# EAGLE design qtpy_synth2a (EAGLE 9.6.2)
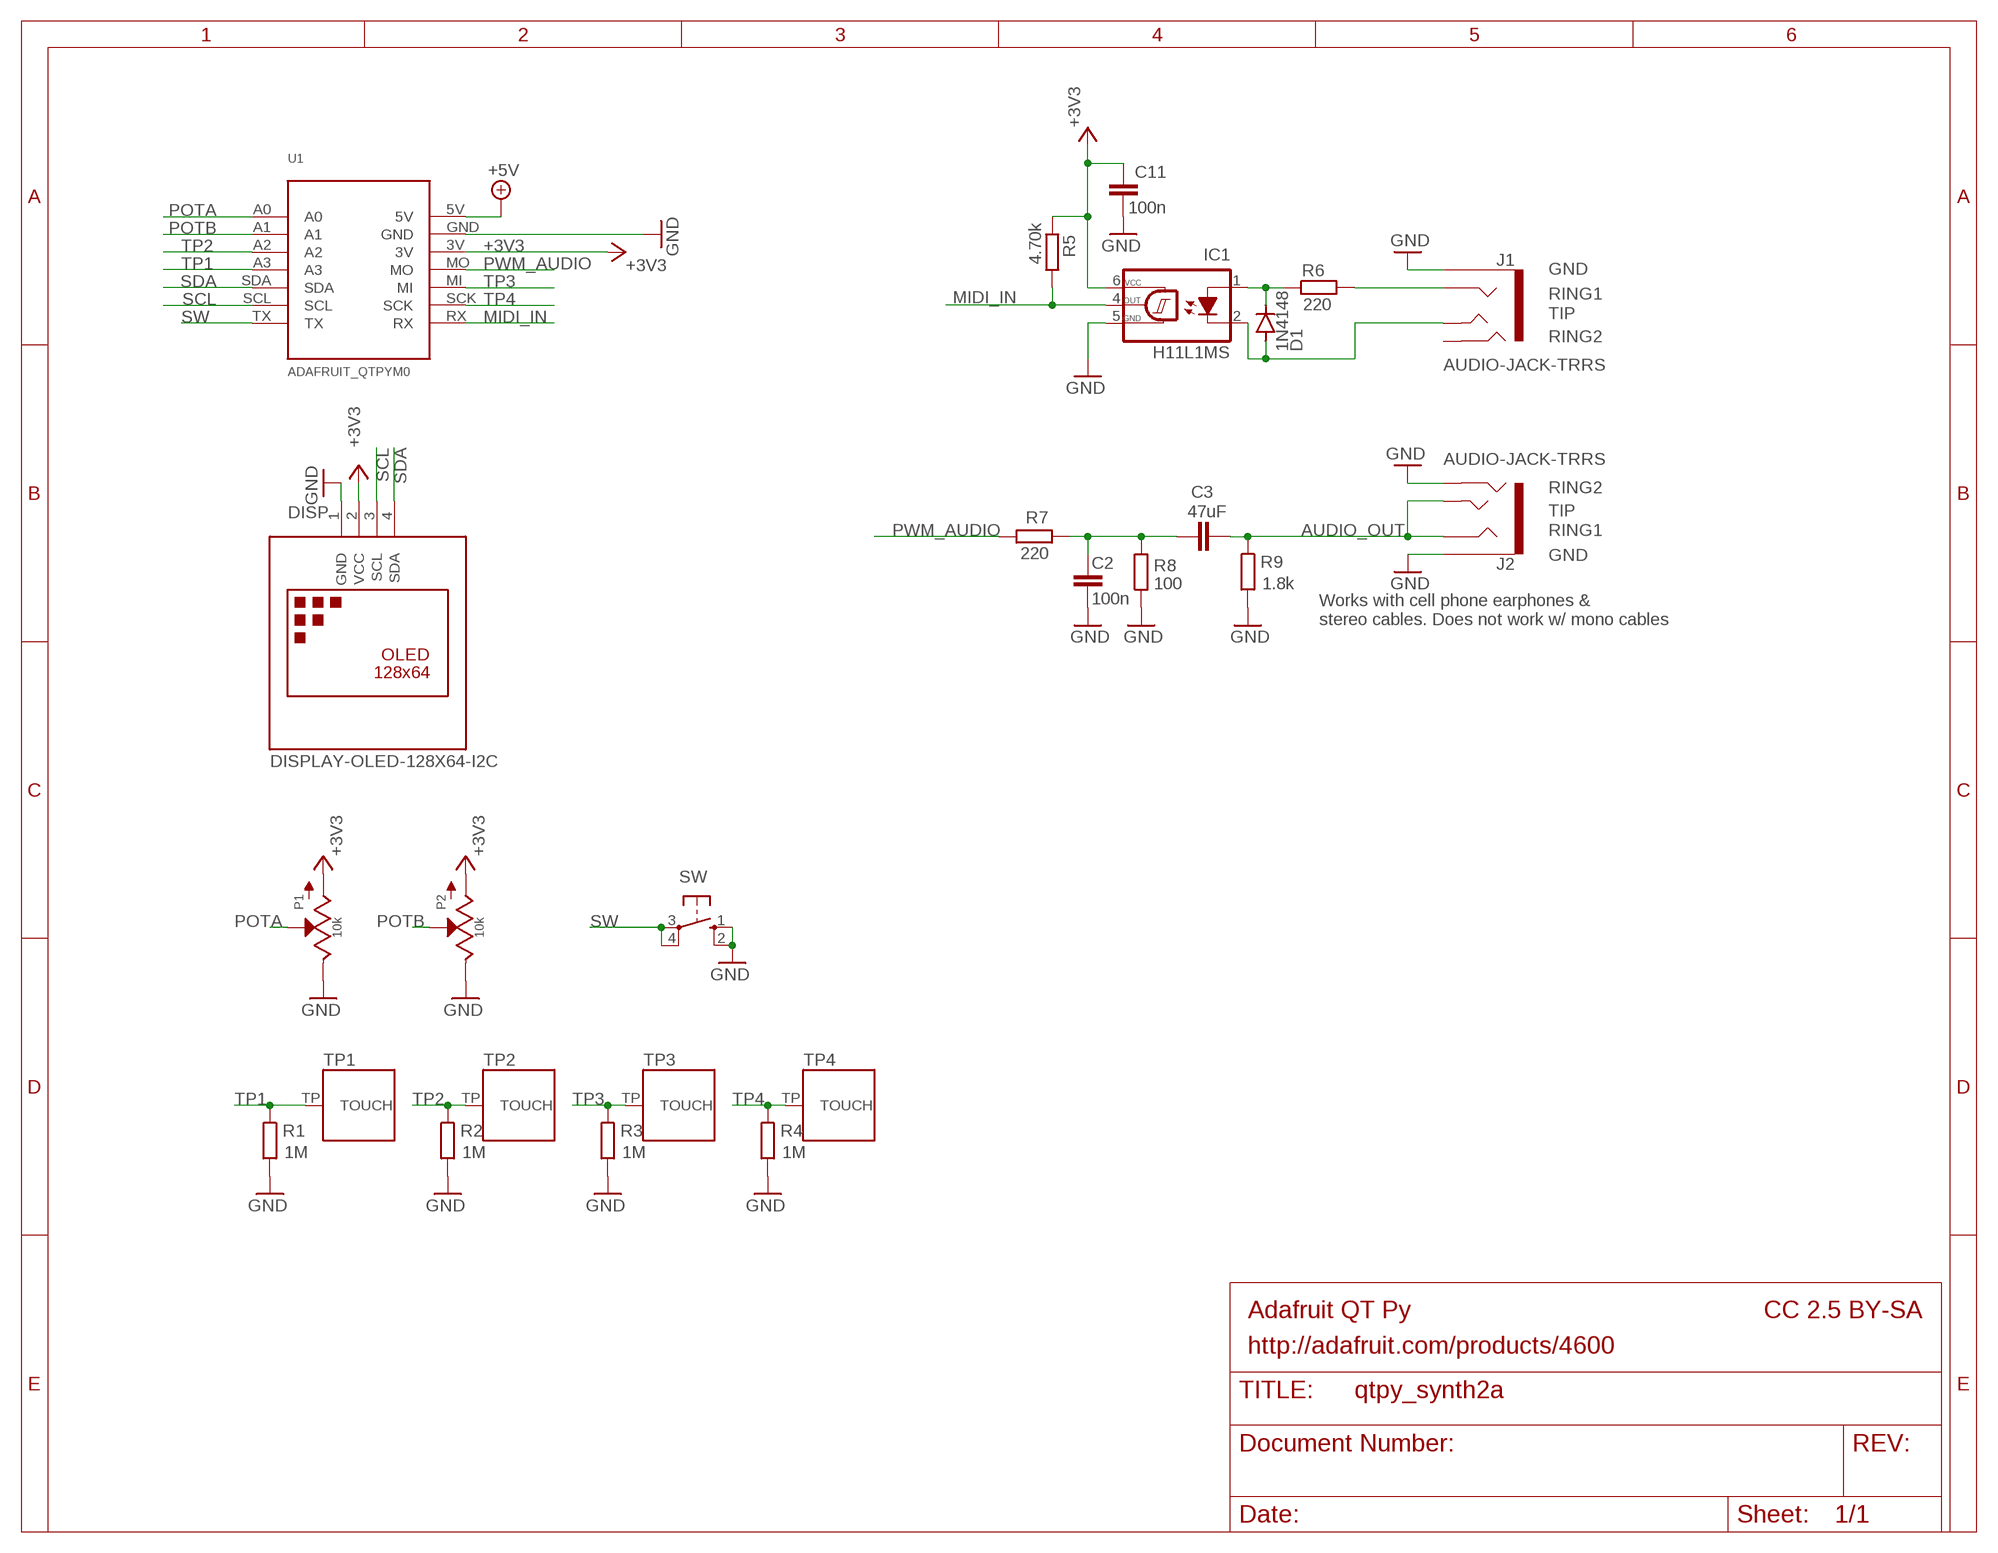
[diagram p0: schematic, sheet 1]

## Parts
C2  100n  C-EUC0805  [C0805]
C3  47uF  C-EUC0805  [C0805]
C11  100n  C-EUC0805  [C0805]
D1  1N4148  DIODE-SOD123  [SOD123]
DISP  DISPLAY-OLED-128X64-I2C  [DISPLAY-OLED-128X64-I2C]
IC1  H11L1MS  [DIL6-SMD]
J1  AUDIO-JACK-TRRS  [PJ-320D_SPARKFUN]
J2  AUDIO-JACK-TRRS  [PJ-320D_SPARKFUN]
P1  10k  POTZEPHPOT_BIGKNOB  [OG-POTS_ALPS_POT_VERTICAL_WITHBIGKNOB]
P2  10k  POTZEPHPOT_BIGKNOB  [OG-POTS_ALPS_POT_VERTICAL_WITHBIGKNOB]
R1  1M  R-EU_R0805  [R0805]
R2  1M  R-EU_R0805  [R0805]
R3  1M  R-EU_R0805  [R0805]
R4  1M  R-EU_R0805  [R0805]
R5  4.70k  R-EU_R0805  [R0805]
R6  220  R-EU_R0805  [R0805]
R7  220  R-EU_R0805  [R0805]
R8  100  R-EU_R0805  [R0805]
R9  1.8k  R-EU_R0805  [R0805]
SW  10-XX  [B3F-10XX]
TP1  TOUCHPADA  [TOUCHPADA_0.5IN]
TP2  TOUCHPADA  [TOUCHPADA_0.5IN]
TP3  TOUCHPADA  [TOUCHPADA_0.5IN]
TP4  TOUCHPADA  [TOUCHPADA_0.5IN]
U1  ADAFRUIT_QTPYM0  [ADAFRUIT_QTPY_M0]

## Nets
+3V3: C11.1 DISP.2(VCC) IC1.6(VCC) P1.P$3(A) P2.P$3(A) R5.1 U1.3V
+5V [power]: U1.5V
AUDIO_OUT: C3.2 J2.RING1 J2.TIP R9.1
GND [power]: C2.2 C11.2 DISP.1(GND) IC1.5(GND) J1.EARTH J2.EARTH J2.RING2 P1.P$1(E) P2.P$1(E) R1.2 R2.2 R3.2 R4.2 R8.1 R9.2 SW.1(S) SW.2(S1) U1.GND
MIDI_IN: IC1.4(OUT) R5.2 U1.RX
N$2: J1.RING1 R6.2
N$13: D1.C IC1.1(A) R6.1
N$14: D1.A IC1.2(C) J1.TIP
N$48: C2.1 C3.1 R7.1 R8.2
POTA: P1.P$2(S) U1.A0
POTB: P2.P$2(S) U1.A1
PWM_AUDIO: R7.2 U1.MO
SCL: DISP.3(SCL) U1.SCL
SDA: DISP.4(SDA) U1.SDA
SW [power]: SW.3(P) SW.4(P1) U1.TX
TP1: R1.1 TP1.TP(TOUCH) U1.A3
TP2: R2.1 TP2.TP(TOUCH) U1.A2
TP3: R3.1 TP3.TP(TOUCH) U1.MI
TP4: R4.1 TP4.TP(TOUCH) U1.SCK
Unconnected: J1.RING2

## Notes on the sheet
- GND
- RING1
- TIP
- RING2
- RING2
- TIP
- RING1
- GND
- Works with cell phone earphones &
  stereo cables. Does not work w/ mono cables
- Adafruit QT Py | CC 2.5 BY-SA
- http://adafruit.com/products/4600

## Library data of the parts
C2 C3 C11 = rcl:C-EU: CAPACITOR, European symbol; SPICEPREFIX: C
D1 = diode:DIODE-: DIODE
DISP = diy-modules:DISPLAY-OLED-128X64-I2C: 128x64 Dot Matrix OLED Module based on SSD1306 chip Variant with I2C interface More details available here: http://www.instructables.com/id/Monochrome-096-i2c-OLED-display-with-arduino-SSD13/ SSD1306 datasheet: https://cdn-shop.adafruit.com/datasheets/SSD1306.pdf Click here to find device on ebay.com <http://www.ebay.com/sch/oled+display+128x64+iic> Note: There are two variants: I2C and SPI. Search for the proper version.
IC1 = optocoupler:H11L*M: 6-Pin DIP Optocoupler Source: http://www.fairchildsemi.com/ds/H1/H11L2-M.pdf; LCSC: C78589; MPN2: H11L1S; OC_FARNELL: unknown; OC_NEWARK: unknown
J1 J2 = audio_jacks_todbot:AUDIO-JACK-TRRS; LCSC: C431535; MPN: PJ-320D
P1 P2 = EurorackModularParts:POT
R1-R9 = rcl:R-EU_: RESISTOR, European symbol; SPICEPREFIX: R
SW = switch-omron:10-XX: OMRON SWITCH; MPN: B3F-1000; OC_FARNELL: 176432; OC_NEWARK: 36M3542
TP1-TP4 = todstuff2023:TOUCHPAD
U1 = todstuff2023:ADAFRUIT_QTPY

## Net classes
1 power: width 0.305 mm
2 thickpower: width 0.406 mm

## Board
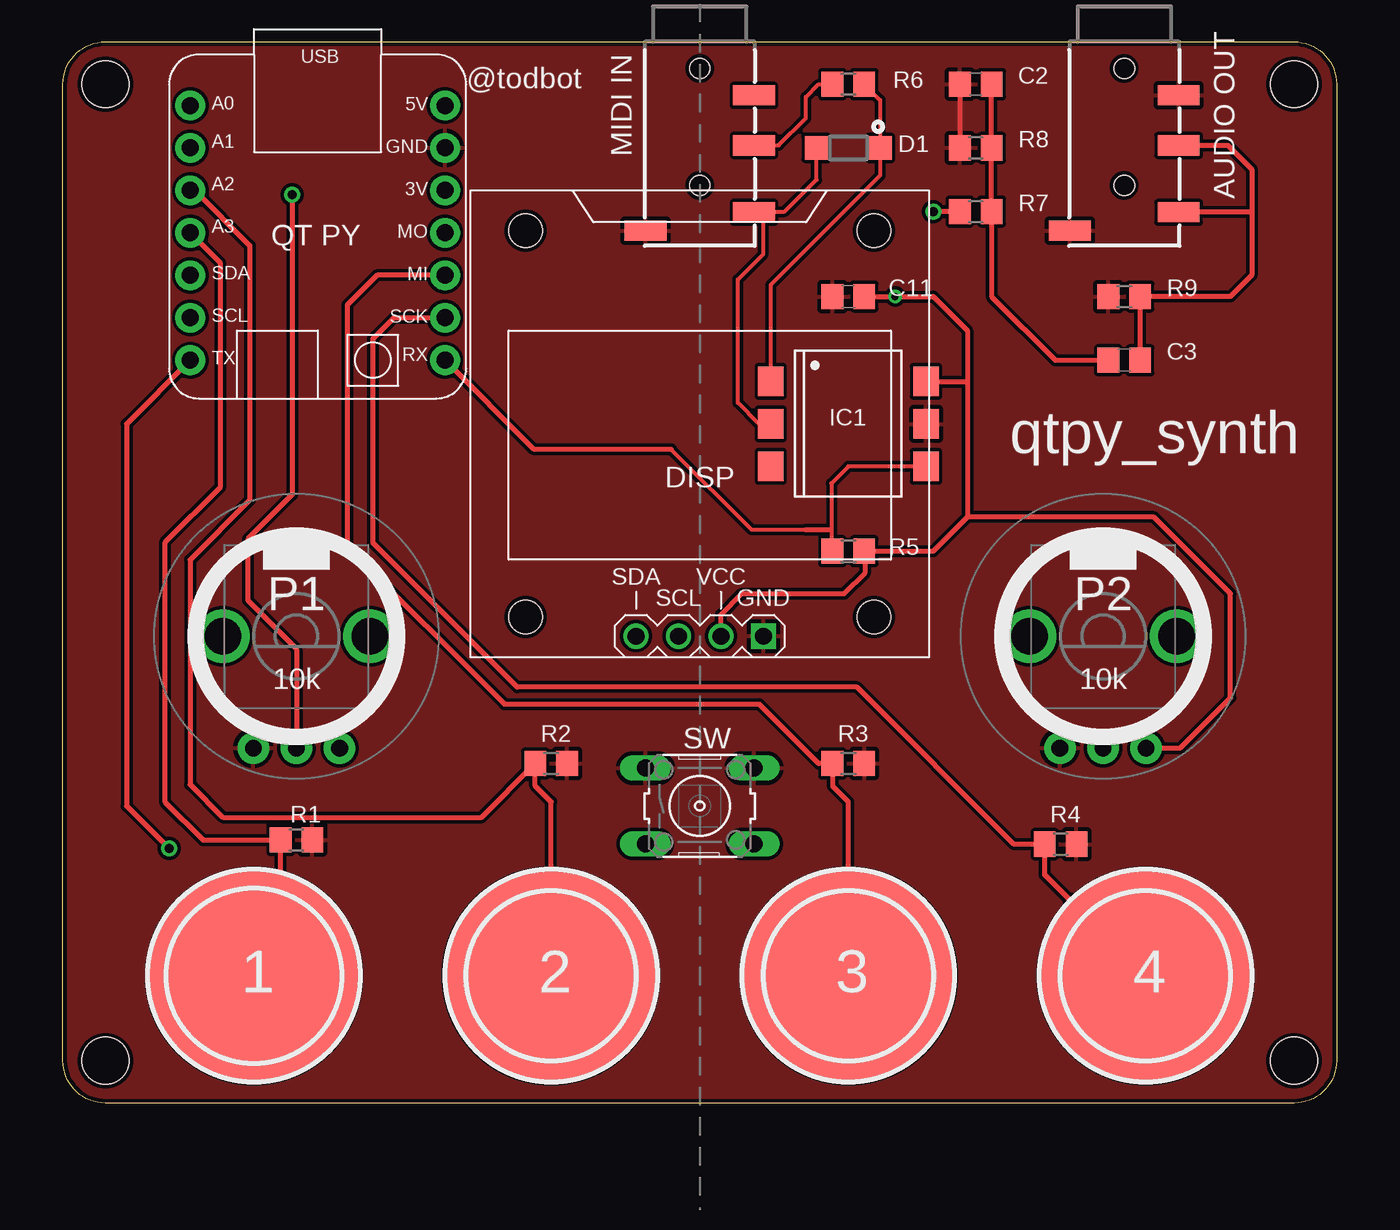
[diagram p1: board, top side]
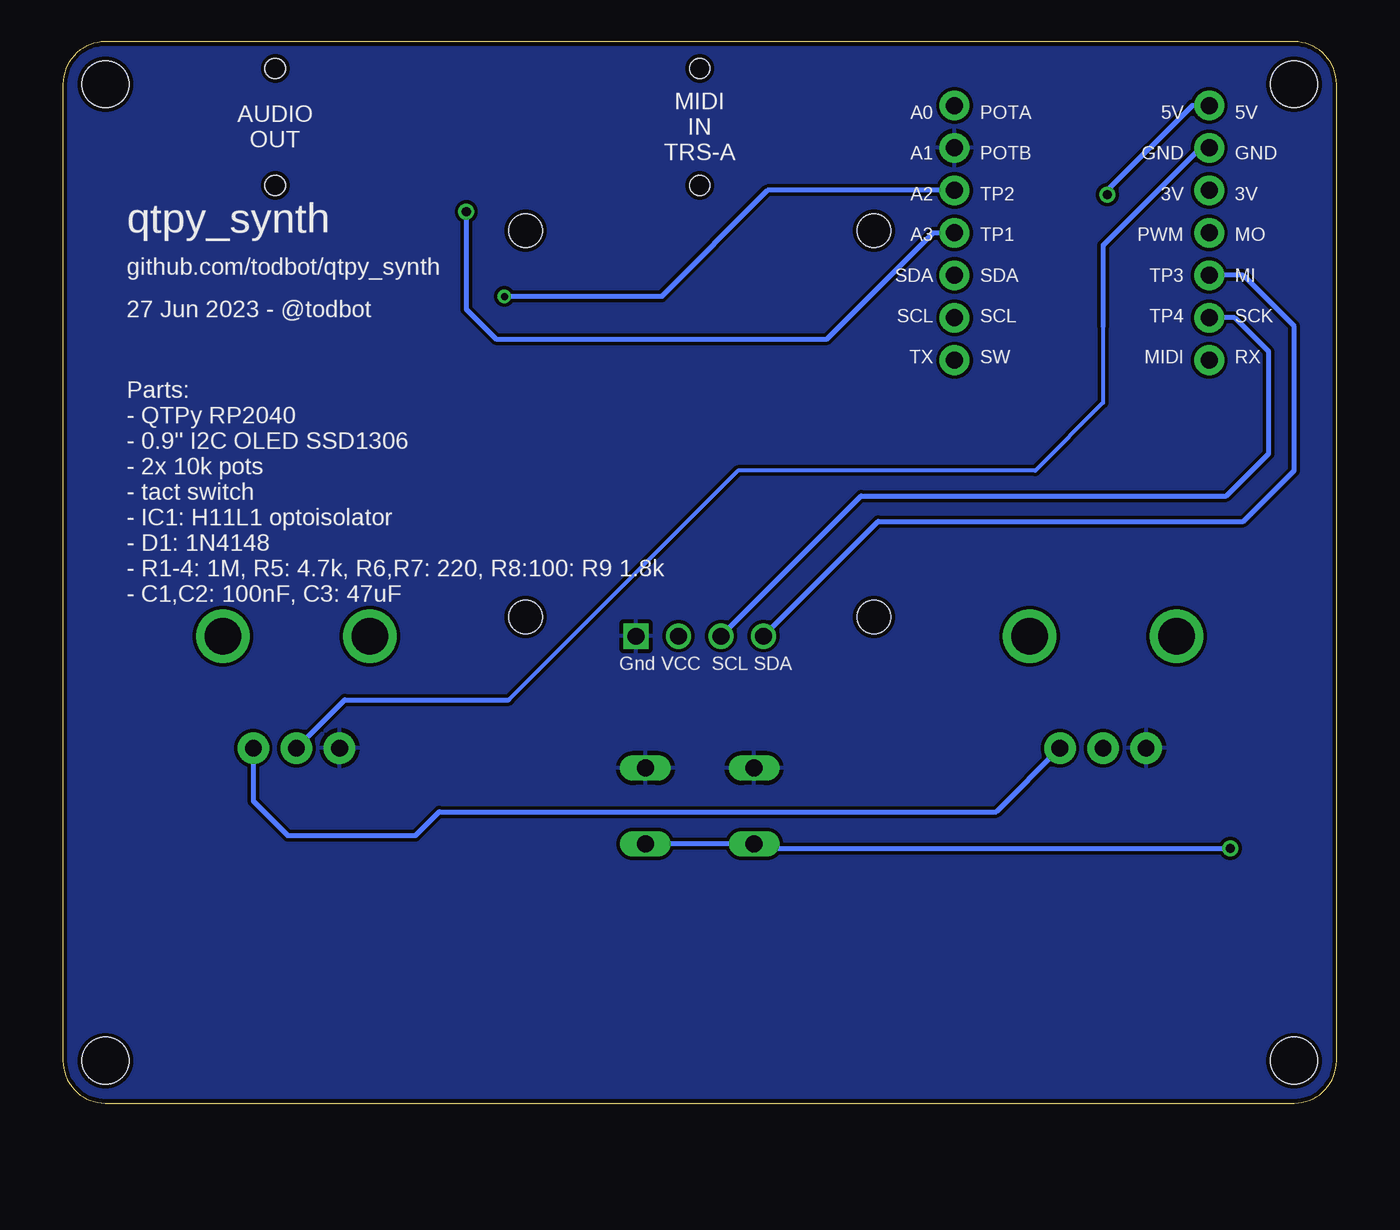
[diagram p2: board, bottom side, seen from below]

Size 76.2 x 63.5 mm. Coordinates in mm from the lower left corner, seen from the top.
Outline: 0,2.54 0,60.96 arc-90 2.54,63.5 73.66,63.5 arc-90 76.2,60.96 76.2,2.54 arc-90 73.66,0 2.54,0 arc-90 0,2.54
Copper layers (1*16): Top 0.035mm / dielectric 1.5mm / Bottom 0.035mm
Design rules "adafruit-rules-20180530 *": minimum track width 8mil, minimum drill 16mil, track to track 8mil, track to pad 8mil, pad to pad 8mil, via to via 8mil, smd to smd 8mil, copper to edge 10mil, drill to drill 8mil, minimum pad ring 10mil, minimum via ring 8mil, stop-mask expansion 4mil, vias tented up to drill 20mil, thermal gap 10mil
Holes 2.79 mm at 2.54,60.96 2.54,2.54 73.66,2.54 73.66,60.96

### Footprints (pad centres in the part's own frame; a part is rotated, then mirrored left to right if it is on the bottom)
C0805 = smd 1.3 x 1.5: 1 -0.95,0; 2 0.95,0
SOD123 = smd 1.4 x 1.4: A 1.9,0; C -1.9,0
DISPLAY-OLED-128X64-I2C = drill 1 square: 1 -3.81,12.7 | drill 1: 2 -1.27,12.7; 3 1.27,12.7; 4 3.81,12.7 | hole 2: -10.414,11.557; 10.414,11.557; 10.414,-11.557; -10.414,-11.557
DIL6-SMD = smd 1.78 x 1.52: 1 -2.54,-4.645; 2 0,-4.645; 3 2.54,-4.645; 4 2.54,4.645; 5 0,4.645; 6 -2.54,4.645
PJ-320D_SPARKFUN = smd 1.2 x 2.5: EARTH 11.3,-3.25; RING1 6.2,3.25; RING2 3.2,3.25; TIP 10.2,3.25 | hole 1.2: 1.6,0; 8.6,0
OG-POTS_ALPS_POT_VERTICAL_WITHBIGKNOB = drill 1 pad 1.88: P$1 -2.58,-6.7; P$2 0,-6.7; P$3 2.58,-6.7 | drill 2.2 pad 3.175: P$4 4.4,0; P$5 -4.4,0
R0805 = smd 1.3 x 1.5: 1 -0.95,0; 2 0.95,0
B3F-10XX = drill 1.016 long: 1 -3.251,2.261; 2 3.251,2.261; 3 -3.251,-2.261; 4 3.251,-2.261
TOUCHPADA_0.5IN = smd 12.7 x 12.7: TP 0,0
ADAFRUIT_QTPY_M0 = drill 1.016 pad 1.778: 3V 7.62,2.54; 5V 7.62,7.62; A0 -7.62,7.62; A1 -7.62,5.08; A2 -7.62,2.54; A3 -7.62,0; GND 7.62,5.08; MI 7.62,-2.54; MO 7.62,0; RX 7.62,-7.62; SCK 7.62,-5.08; SCL -7.62,-5.08; SDA -7.62,-2.54; TX -7.62,-7.62

### Placement (x,y rotation side)
C2  54.61,60.96 180 top
C3  63.5,44.45 0 top
C11  46.99,48.26 180 top
D1  46.99,57.15 180 top
DISP  38.1,40.64 180 top
IC1  46.99,40.64 270 top
J1  38.1,63.5 270 top
J2  63.5,63.5 270 top
P1  13.97,27.94 0 top
P2  62.23,27.94 0 top
PLABEL19  [PLABEL19]  8.89,63.5 0 bottom
R1  13.97,15.75 0 top
R2  29.21,20.32 0 top
R3  46.99,20.32 0 top
R4  59.69,15.49 0 top
R5  46.99,33.02 180 top
R6  46.99,60.96 180 top
R7  54.61,53.34 180 top
R8  54.61,57.15 0 top
R9  63.5,48.26 180 top
SW  38.1,17.78 0 top
TP1  11.43,7.62 0 top
TP2  29.21,7.62 0 top
TP3  46.99,7.62 0 top
TP4  64.77,7.62 0 top
U1  15.24,52.07 0 top

### Tracks (layer width: path | path; a pad name or v marks a point on that pad's centre or on a via)
+3V3  (via drill 0.41)
  Top 0.305: P2.P$3 66.84,21.24 69.85,24.25 69.85,30.48 65.28,35.05 54.1,35.05 | DISP.2 39.37,29.21 40.64,30.48 46.74,30.48 48.01,31.75 48.01,32.95 R5.1 52.07,33.02 54.1,35.05 | 54.1,43.18 54.1,46.23 52.07,48.26 v49.78,48.26 C11.1 | 54.1,43.18 54.1,35.05 | IC1.6 54.1,43.18
  Bottom 0.305: P1.P$3 20.36,17.43 53.69,17.43 55.12,16 62.74,16 64.81,18.07 P2.P$3 | v49.78,48.26 40.39,48.26 34.04,54.61 U1.3V
AUDIO_OUT
  Top 0.305: C3.2 R9.1 69.85,48.26 71.12,49.53 71.12,53.34 | J2.RING1 69.7,57.3 71.12,55.88 71.12,53.34 | J2.TIP 66.79,53.34 71.12,53.34
GND
  Top 0.305: C2.2 R8.1
  pour Bottom: 0,0 0,63.75 76.2,63.75 76.2,0
  pour Top: 0,63.5 77.47,63.5 77.47,0 0,0
MIDI_IN
  Top 0.254: 36.4,39.12 41.22,34.29 44.45,34.29 | IC1.4 46.99,38.1 45.97,37.08 45.97,34.29 45.97,33.02
  Top 0.305: U1.RX 28.19,39.12 36.4,39.12 | R5.2 45.97,33.02 | 45.97,34.29 44.45,34.29
N$2
  Top 0.254: J1.RING1 42.82,57.3 44.45,58.93 44.45,60.2 45.21,60.96 R6.2
N$13
  Top 0.254: R6.1 48.89,60.01 D1.C 48.89,55.49 42.34,48.95 IC1.1
N$14
  Top 0.254: J1.TIP 41.39,53.34 41.91,53.34 | 41.91,53.34 43.18,53.34 45.09,55.25 D1.A | IC1.2 41.66,40.64 40.39,41.91 40.39,48.26 40.39,49.28 41.91,50.8 41.91,53.34
N$48
  Top 0.305: C2.1 R8.2 R7.1 55.56,48.26 59.37,44.45 C3.1
POTA  (via drill 0.55)
  Top 0.305: v13.72,54.36 13.72,36.41 11.06,33.75 11.06,30.1 13.97,27.18 P1.P$2
  Bottom 0.305: U1.A0 8.64,59.69 13.72,54.61 v13.72,54.36
POTB
  Bottom 0.254: 13.97,46.48 13.97,41.91 18.03,37.85 35.81,37.85 49.53,24.13
  Bottom 0.305: U1.A1 8.13,57.15 13.97,51.31 13.97,46.48 | P2.P$2 59.34,24.13 49.53,24.13
PWM_AUDIO  (via drill 0.55)
  Top 0.305: R7.2 v52.07,53.34
  Bottom 0.305: v52.07,53.34 52.07,47.5 50.29,45.72 30.48,45.72 24.13,52.07 U1.MO
SCL
  Bottom 0.305: U1.SCL 6.1,46.99 4.06,44.96 4.06,38.86 6.6,36.32 28.45,36.32 DISP.3
SDA
  Bottom 0.305: DISP.4 27.43,34.8 5.59,34.8 2.54,37.85 2.54,46.48 5.59,49.53 U1.SDA
SW  (via drill 0.55)
  Top 0.305: U1.TX 3.81,40.64 3.81,17.78 v6.35,15.24
  Bottom 0.305: v6.35,15.24 34.57,15.24 SW.3 SW.4
TP1
  Top 0.305: U1.A3 9.4,50.29 9.4,36.83 6.1,33.53 6.1,18.03 8.38,15.75 R1.1 13.02,9.21 TP1.TP
TP2
  Top 0.305: U1.A2 7.87,54.61 11.18,51.31 11.18,36.07 7.61,32.5 7.61,19.06 9.56,17.11 25.05,17.11 R2.1 28.26,18.98 29.21,18.03 TP2.TP
TP3
  Top 0.305: TP3.TP 46.99,18.03 46.04,18.98 R3.1 45.21,20.32 41.66,23.88 26.42,23.88 17.02,33.27 17.02,47.75 18.8,49.53 U1.MI
TP4
  Top 0.305: TP4.TP 58.74,13.65 R4.1 56.9,15.49 47.5,24.89 27.18,24.89 18.54,33.53 18.54,45.72 19.81,46.99 U1.SCK

### Text on the board
tPlace: @todbot | MIDI IN | AUDIO OUT | qtpy_synth | 1 | 2 | 3 | 4
bPlace: 5V / / GND / / 3V / / MO / / MI / / SCK / / RX | 5V / / GND / / 3V / / PWM / / TP3 / / TP4 / / MIDI | POTA / / POTB / / TP2 / / TP1 / / SDA / / SCL / / SW | A0 / / A1 / / A2 / / A3 / / SDA / / SCL / / TX | AUDIO / OUT | MIDI / IN / TRS-A | qtpy_synth | github.com/todbot/qtpy_synth | 27 Jun 2023 - @todbot | Parts: / - QTPy RP2040 / - 0.9" I2C OLED SSD1306 / - 2x 10k pots / - tact switch / - IC1: H11L1 optoisolator / - D1: 1N4148 / - R1-4: 1M, R5: 4.7k, R6,R7: 220, R8:100: R9 1.8k / - C1,C2: 100nF, C3: 47uF | Gnd VCC SCL SDA
Pinguin_tBackup: 5V | A0 | A1 | G | 3V | S | A2 | - | A3 | MO | + | MI | SDA | SCK | SCL | RX | Sig | TX | NeoPixel BFF
Pinguin_bBackup: USB | NeoPixel Driver / Neo+ <-> 5V / QT Py. Solder / back to back / Signal on A3